# EAGLE schematic ArduinoRadioV2 (EAGLE 9.5.2)
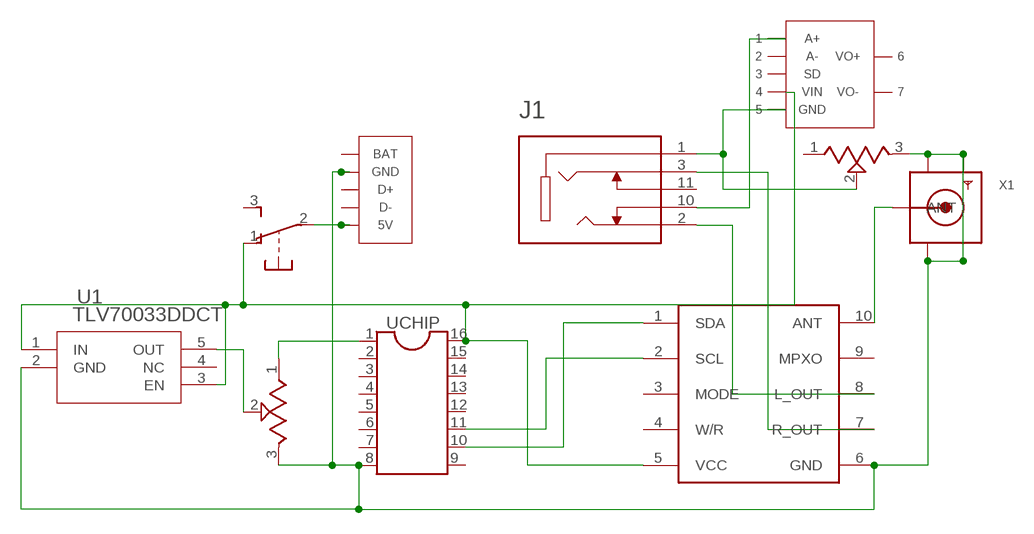
[diagram p0: schematic, sheet 1]

## Parts
IC1  UCHIP  [UCHIP]
J1  SJ1-3525N  [CUI_SJ1-3525N]
S1  EG1213  [EG1213]
TEA5767  TEA5767BREAKOUT  [TEA5767MM2]
TUNE  3352T-1-103LF  [TRIM_3352T-1-103LF]
U1  TLV70033DDCT  [DDC5]
U$1  AMP  [AMP]
U$2  MICROLIPO  [MICROLIPO]
VOL  3352T-1-103LF  [TRIM_3352T-1-103LF]
X1  SMACONNECTOR  [SMA90_DIP]

## Nets
5V: IC1.16(V_EXT) S1.1(1:O) TEA5767.5(VCC) U1.1(IN) U1.3(EN) U$1.VIN
AIN: J1.10 U$1.A+
ANT: TEA5767.10(ANT) X1.ANTENNA(ANT)
GND: IC1.8(GND) TEA5767.6(GND) TUNE.3(CW) U1.2(GND) U$2.P$1(GND) U$2.P$2(GND) U$2.P$3(GND) U$2.P$4(GND) U$2.P$8(GND) VOL.3(CW) X1.GND1 X1.GND2 X1.GND3 X1.GND4
LO: J1.2 TEA5767.8(L_OUT)
N$2: IC1.1(D1/A1) TUNE.1(CCW)
RO: J1.3 TEA5767.7(R_OUT)
SCL: IC1.11(D11) TEA5767.2(SCL)
SDA: IC1.10(D10) TEA5767.1(SDA)
TUNE: TUNE.2(WIPER) U1.5(OUT)
VOL: J1.1 U$1.GND VOL.2(WIPER)
VS: S1.2(1:P) U$2.P$5(5V)
Unconnected: IC1.2(D2/A2) IC1.3(D3/A3) IC1.4(D4/A4) IC1.5(D5/A5) IC1.6(D6) IC1.7(D7) IC1.9(D9) IC1.12(D12) IC1.13(D13) IC1.14(D14/A14) IC1.15(D15/A15) J1.11 S1.3(1:S) S1.MT1(MT) S1.MT2(MT) TEA5767.3(MODE) TEA5767.4(W/R) TEA5767.9(MPXO) U1.4(NC) U$1.A- U$1.SD U$1.VO+ U$1.VO- U$2.P$6(D-) U$2.P$7(D+) U$2.P$9(BAT) VOL.1(CCW)

## Library data of the parts
IC1 = uChip:UCHIP: uChip: Arduino Zero compatible board in a DIL16 Package
J1 = SJ1-3525N:SJ1-3525N: 3.5 mm Right-Angle Stereo Jack, 5 Pin PCB Mount, Non-Threaded; AVAILABILITY: Unavailable; CUI_PURCHASE_URL: https://www.cuidevices.com/product/interconnect/connectors/audio-connectors/jacks/sj1-352xn-series?utm_source=snapeda.com&utm_medium=referral&utm_campaign=snapedaBOM; DESCRIPTION: 3.5 mm, Stereo, Right Angle, Through Hole, Audio Jack Connector; MF: CUI Devices; MP: SJ1-3525N; PACKAGE: None; PRICE: None
S1 = adafruit:EG1213: E-Switch right-angle slide SPDT Part #EG1213 http://www.ladyada.net/library/eagle
TEA5767 = MyParts:TEA5767BREAKOUT
TUNE VOL = 3352T-1-103LF:3352T-1-103LF: 10 kOhms 0.5W, 1/2W Through Hole Thumbwheel Potentiometer Top Adjustment; DESCRIPTION: 10 kOhms 0.5W, 1/2W Through Hole Thumbwheel Potentiometer Top Adjustment; DIGI-KEY_PART_NUMBER: 3352T-103LF-ND; DIGI-KEY_PURCHASE_URL: https://www.digikey.com/product-detail/en/bourns-inc/3352T-1-103LF/3352T-103LF-ND/1088341?utm_source=snapeda&utm_medium=aggregator&utm_campaign=symbol; MF: Bourns; MP: 3352T-1-103LF; PACKAGE: 2012 Bourns
U1 = ul_TLV70033DDCT:TLV70033DDCT; BUILT_BY: EMA_UL_Team; MANUFACTURER: Texas Instruments; MANUFACTURER_PART_NUMBER: TLV70033DDCT; VENDOR: Texas Instruments
U$1 = amp:AMP
U$2 = microlipo:MICROLIPO
X1 = better14pin:SMACONNECTOR: SMA Connector 90° DIP SMA Connector, 50 Ohm (4UConnector: 07259)